# EasyEDA Pro project ProPrj_Y车Y形板_2025-09-30.epro, board 梯形DRV_1
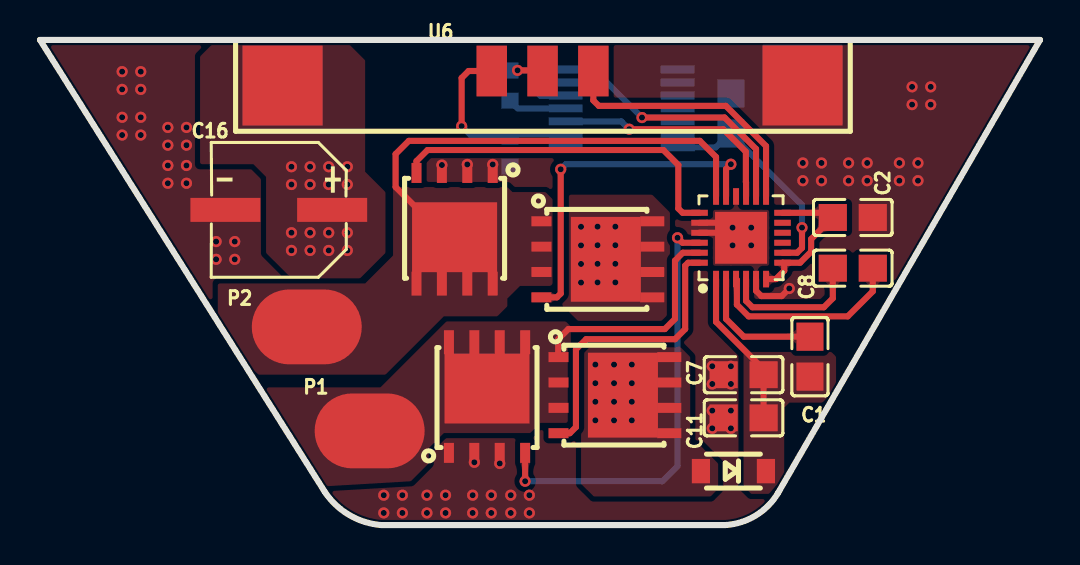
[diagram p12: board, top side]
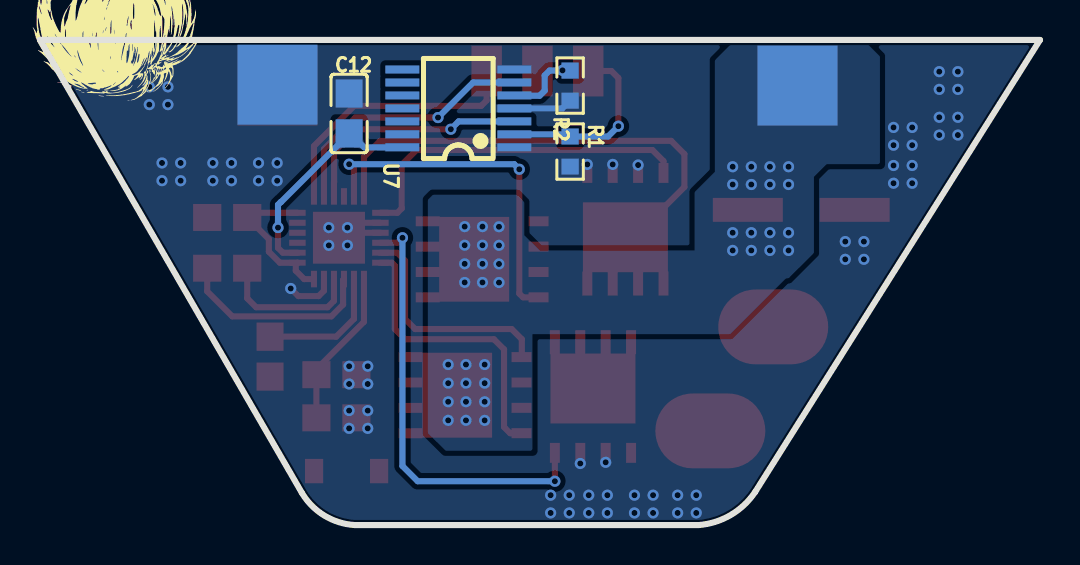
[diagram p13: board, bottom side, seen from below]

Outline 50 x 24.29 mm; copper layers: Top Layer, Bottom Layer. Coordinates in mm from the lower left corner of the outline.
Outline path: 0,24.29 14.24,1.66 arc(15.46,0.51) 17.06,0 34.26,0 arc(35.79,0.48) 36.91,1.62 50,24.29 0,24.29
Stack: Top Layer 0.035mm - / Dielectric1 1.51mm FR4 er 4.5 / Bottom Layer 0.035mm -

## Design rules (mm)
template: 自定义配置
spacing copperThickness1oz (default): track to track 0.152, other pairs 0.152 to 0.3
spacing copperThickness2oz: track to track 0.203, other pairs 0.152 to 0.3
track width copperThickness1oz (default): min 0.254, default 0.254, max 2.54
track width copperThickness2oz: min 0.203, default 0.254, max 2.54
differential pair differentialPair (default): width min 0.127, default 0.254, max 2.54; gap min 0.152, default 0.152
via viaSize (default): diameter min 0.5, default 0.61, max 10; hole min 0.3, default 0.305, max 6.299

## Placement (name value [footprint] x y rotation side)
C1  1uF  [C0805]  38.5 8.43 270 top
C2  1uF  [C0805]  40.64 15.4 180 top
C7  100nF  [C0805]  35.18 7.53 180 top
C8  100nF  [C0805]  40.64 12.86 0 top
C11  10uF  [C0805]  35.18 5.37 180 top
C12  1uF  [C0805]  34.54 20.61 270 bottom
C16  220uF  [CAP-SMD_BD6.3-L6.6-W6.6-FD]  11.94 15.78 180 top
D2  1N5819W  [SOD-123_L2.7-W1.6-LS3.7-R-RD]  34.67 2.7 180 top
P1  WirePad  [WirePad-4x6]  16.48 4.72 0 top
P2  WirePad  [WirePad-4x6]  13.34 9.92 0 top
Q1  TPH1R403NL  [DSOP-8_L5.0-W5.0-P1.27-LS6.0-BL-EP]  28.7 6.5 270 top
Q2  TPH1R403NL  [DSOP-8_L5.0-W5.0-P1.27-LS6.0-BL-EP]  22.35 6.39 0 top
Q3  TPH1R403NL  [DSOP-8_L5.0-W5.0-P1.27-LS6.0-BL-EP]  27.84 13.31 270 top
Q4  TPH1R403NL  [DSOP-8_L5.0-W5.0-P1.27-LS6.0-BL-EP]  20.73 14.86 180 top
R1  10kΩ  [R0603]  23.5 18.7 270 bottom
R2  10kΩ  [R0603]  23.5 22.01 90 bottom
U4  DRV8701ERGET  [VQFN-24_L4.0-W4.0-P0.50-BL-EP2.5]  35.05 14.39 0 top
U6  -  [DRV8701连接焊盘]  9.78 24.29 0 top
U7  SN74HC125PW(LX)  [TSSOP-14_L5.0-W4.4-P0.65-LS6.4-BL]  29.08 20.86 90 bottom

## Footprints (pads in the part's own frame, mm; a bottom-side part is the same pattern mirrored in y, then rotated)
C0805
  rect 1.41x1.35 smd: 1(-1,0) 2(1,0)
CAP-SMD_BD6.3-L6.6-W6.6-FD
  rect 3.5x1.2 smd: 1(-2.67,0) 2(2.67,0)
DRV8701连接焊盘
  rect 4x4 smd far side: 1(28.348,-2.24) 2(2.348,-2.286)
  rect 4x4 smd: 1(28.348,-2.286) 2(2.348,-2.286)
  rect 1.524x2.54 smd: 3(17.888,-1.556) 4(15.348,-1.556) 5(12.808,-1.556)
DSOP-8_L5.0-W5.0-P1.27-LS6.0-BL-EP
  rect 0.5x1 smd: 1(-1.905,-2.77) 2(-0.635,-2.77) 3(0.634,-2.77) 4(1.905,-2.77)
  rect 0.5x1.2 smd: 5(1.905,2.77) 6(0.635,2.77) 7(-0.634,2.77) 8(-1.905,2.77)
  custom 4.25x3.5 smd: 9(0,0.45)
R0603
  rect 0.806x0.864 smd: 1(-0.753,0) 2(0.753,0)
SOD-123_L2.7-W1.6-LS3.7-R-RD
  rect 0.909x1.219 smd: 1(1.625,0) 2(-1.625,0)
TSSOP-14_L5.0-W4.4-P0.65-LS6.4-BL
  rect 0.4x1.7 smd: 1(-1.95,-2.8) 2(-1.3,-2.8) 3(-0.65,-2.8) 4(0,-2.8) 5(0.65,-2.8) 6(1.3,-2.8) 7(1.95,-2.8) 8(1.95,2.8) 9(1.3,2.8) 10(0.65,2.8) 11(0,2.8) 12(-0.65,2.8) 13(-1.3,2.8) 14(-1.95,2.8)
VQFN-24_L4.0-W4.0-P0.50-BL-EP2.5
  rect 0.3x0.828 smd: 1(-1.25,-2.07) 2(-0.75,-2.07) 3(-0.25,-2.07) 4(0.25,-2.07) 5(0.75,-2.07) 6(1.25,-2.07) 13(1.25,2.068) 14(0.75,2.068) 15(0.25,2.068) 16(-0.25,2.068) 17(-0.75,2.068) 18(-1.25,2.068)
  rect 0.828x0.3 smd: 7(2.076,-1.25) 8(2.076,-0.75) 9(2.076,-0.25) 10(2.076,0.25) 11(2.076,0.75) 12(2.076,1.25) 19(-2.075,1.25) 20(-2.075,0.75) 21(-2.075,0.25) 22(-2.075,-0.25) 23(-2.075,-0.75) 24(-2.075,-1.25)
  rect 2.6x2.6 smd: 25(0.001,-0.001)
WirePad-4x6
  rrect 5.5x3.75 smd: 1(0,0)

## Nets
As in the schematic.

Pads without a net: U4 9 10 11; U7 8 9 10 11 12 13

## Via types
v1: diameter 0.559, hole 0.305, Top Layer to Bottom Layer, 119 vias

## Routing (per net, layer and track width the routed paths; a pad name or vN(x,y) marks a point on that pad's centre or on a via; arc(x,y) is an arc through that point)
DVDD: length 11.2
  Top Layer w0.305: v1(38.1,14.89) 38.1,13.88 37.86,13.64 U4.8
  Bottom Layer w0.305: v1(38.1,14.89) 38.1,16.04 37.97,16.16 37.96,16.16 34.54,19.58 C12.2 33.78,18.91 U7.14
GND: length 9.7
  Top Layer w0.305: U4.5 35.8,11.73 36.07,11.47 37.08,11.47 v1(37.47,11.85) ; U4.20 34.3,15.14 34.8,14.64 ; 34.8,14.64 U4.25 ; 34.8,14.64 U4.21
  Bottom Layer w0.305: R2.1 23.88,20.86 U7.4
  vias: v1(4.11,22.7) v1(4.11,21.82) v1(4.11,20.42) v1(4.11,19.53) v1(5.04,22.7) v1(5.04,21.82) v1(5.04,20.42) v1(5.04,19.53) v1(6.39,19.91) v1(6.39,19.02) v1(6.39,18.01) v1(6.39,17.12) v1(7.32,19.91) v1(7.32,19.02) v1(7.32,18.01) v1(7.32,17.12) v1(8.81,14.2) v1(8.81,13.31) v1(9.74,14.2) v1(9.74,13.31) v1(17.19,1.5) v1(17.19,0.61) v1(18.12,1.5) v1(18.12,0.61) v1(19.35,1.5) v1(19.35,0.61) v1(20.09,18.03) v1(20.28,1.5) v1(20.28,0.61) v1(21.37,18.06) v1(21.63,1.5) v1(21.63,0.61) v1(21.72,3.14) v1(22.63,18.06) v1(22.56,1.5) v1(22.56,0.61) v1(22.99,3.08) v1(23.54,1.5) v1(23.54,0.61) v1(24.47,1.5) v1(24.47,0.61) v1(33.61,7.95) v1(33.61,7.06) v1(33.61,5.73) v1(33.61,4.84) v1(34.54,7.95) v1(34.54,7.06) v1(34.54,5.73) v1(34.54,4.84) v1(34.63,14.89) v1(34.63,14.01) v1(35.56,14.89) v1(35.56,14.01) v1(38.14,18.13) v1(38.14,17.24) v1(39.07,18.13) v1(39.07,17.24) v1(40.43,18.13) v1(40.43,17.24) v1(41.36,18.13) v1(41.36,17.24) v1(42.97,18.13) v1(42.97,17.24) v1(43.6,21.94) v1(43.6,21.05) v1(43.9,18.13) v1(43.9,17.24) v1(44.53,21.94) v1(44.53,21.05)
VIN:
  vias: v1(12.57,17.94) v1(12.57,17.05) v1(12.57,14.64) v1(12.57,13.75) v1(13.5,17.94) v1(13.5,17.05) v1(13.5,14.64) v1(13.5,13.75) v1(14.44,17.94) v1(14.44,17.05) v1(14.44,14.64) v1(14.44,13.75) v1(15.37,17.94) v1(15.37,17.05) v1(15.37,14.64) v1(15.37,13.75) v1(27.05,14.94) v1(27.05,14.01) v1(27.05,13.07) v1(27.05,12.14) v1(27.77,8.04) v1(27.77,7.11) v1(27.77,6.17) v1(27.77,5.24) v1(27.88,14.94) v1(27.88,14.01) v1(27.88,13.08) v1(27.88,12.15) v1(28.7,8.04) v1(28.7,7.11) v1(28.7,6.17) v1(28.7,5.24) v1(28.77,14.94) v1(28.77,14.01) v1(28.77,13.08) v1(28.77,12.15) v1(29.59,8.04) v1(29.59,7.11) v1(29.59,6.17) v1(29.59,5.24)
EN: length 13.3
  Top Layer w0.305: v1(30.1,20.41) 34.23,20.41 35.8,18.83 U4.14
  Bottom Layer w0.305: v1(30.1,20.41) 28.34,22.16 U7.6
EN_IN: length 5
  Top Layer w0.305: U6.4 25.09,22.77 v1(23.88,22.77)
  Bottom Layer w0.305: U7.5 26.27,21.5 25.02,21.5 24.76,21.75 24.76,22.51 24.52,22.76 R2.2
MOTOR_A: length 11.5
  Top Layer w0.305: U4.23 32.14,13.64 31.75,13.24 31.75,10.32 31.24,9.81 26.42,9.81 25.91,9.31 25.91,8.43 Q1.1
MOTOR_B: length 24.2
  Top Layer w0.305: 20.73,14.41 20.29,14.41 17.78,16.93 17.78,18.58 18.44,19.24 32.99,19.24 33.8,18.43 U4.18
NSLEEP: length 13.6
  Top Layer w0.305: U4.13 36.3,18.98 34.29,20.99 27.94,20.99 27.67,21.26 U6.3
PH: length 11.9
  Top Layer w0.305: v1(29.46,19.82) 34.16,19.82 35.29,18.69 35.29,17.18 35.3,17.17 U4.15
  Bottom Layer w0.305: v1(29.46,19.82) 29.07,20.21 U7.3
PH_IN: length 9.5
  Top Layer w0.305: U6.5 21.43,22.74 21.08,22.39 v1(21.08,19.97)
  Bottom Layer w0.305: v1(21.08,19.97) 21.6,19.46 R1.1 23.6,19.56 U7.2
$1N8377: length 6.6
  Top Layer w0.305: U4.2 34.3,10.32 35.19,9.43 C1.1
$1N8380: length 10
  Top Layer w0.305: U4.3 34.84,12.27 34.84,11.04 35.43,10.45 40.39,10.45 41.64,11.7 C8.2
$1N8381: length 7.3
  Top Layer w0.305: C8.1 39.64,11.35 39.19,10.91 35.62,10.91 35.3,11.23 U4.4
$1N8402: length 14.7
  Top Layer w0.305: Q1.4 26.49,4.6 26.8,4.91 26.8,8.8 27.31,9.31 31.75,9.31 32.26,9.81 32.26,12.99 32.41,13.14 U4.24
$1N8405: length 22
  Top Layer w0.305: v1(24.26,2.2) Q2.4 ; v1(31.88,14.39) 32.13,14.14 U4.22
  Bottom Layer w0.305: v1(24.26,2.2) 31.12,2.2 31.88,2.96 v1(31.88,14.39)
$1N8407: length 17.6
  Top Layer w0.305: Q4.4 18.82,18.23 19.38,18.78 31.17,18.78 31.92,18.03 31.92,15.85 32.13,15.64 U4.19
$1N8411: length 7.6
  Top Layer w0.305: 36.18,5.74 C7.1 36.18,7.8 33.8,10.18 U4.1
$1N14151: length 7.9
  Top Layer w0.305: U4.6 36.79,12.32 37.21,12.74 37.21,13.05 U4.7 38,13.14 38.56,13.69 38.56,14.32 C2.2 39.41,15.64 U4.12
$1N14297: length 17.6
  Top Layer w0.305: v1(26.03,17.82) 26.03,11.59 25.85,11.4 25.07,11.4 ; v1(34.54,18.07) 34.3,17.83 U4.17
  Bottom Layer w0.305: v1(26.03,17.82) 26.29,18.07 v1(34.54,18.07)

## Copper pours and planes (outline as drawn; the poured copper is in the pictures)
GND on Top Layer: -1.14,29.37 49.78,29.37 49.78,-4.03 -1.14,-4.03
GND on Bottom Layer: -2.54,31.02 49.78,31.02 49.78,-6.7 -2.54,-6.7
VIN on Top Layer: 8.7,24.17 15.37,24.17 16.26,23.28 16.26,17.69 17.27,16.67 17.27,13.62 16,12.35 12.57,12.35 11.3,13.62 11.3,17.43 10.67,18.07 8,18.07 8,23.47
VIN on Top Layer: 26.03,16.55 30.61,16.55 31.5,15.66 31.5,9.43 32.51,8.42 32.51,3.97 33.02,3.97 33.91,3.08 33.91,1.81 33.53,1.43 27.69,1.43 27.05,2.07 27.05,10.07 26.03,11.08
VIN on Bottom Layer: 17.15,13.75 25.02,13.75 25.78,14.51 25.78,16.16 26.16,16.55 30.35,16.55 30.61,16.29 30.61,4.61 29.72,3.72 25.38,3.72 25.38,9.56 15.49,9.56 12.45,12.61 15.87,12.61
VIN on Bottom Layer: 8.7,24.17 15.37,24.17 16.26,23.28 16.26,17.69 17.27,16.67 17.27,13.62 16,12.36 12.57,12.36 11.3,13.62 11.3,17.44 10.67,18.07 8,18.07 8,23.47
MOTOR_A on Top Layer: 20.32,10.2 26.29,10.2 26.54,9.94 26.54,5.24 26.42,5.12 25.02,5.12 24.51,4.61 20.19,4.61 19.43,3.85 19.43,3.08 18.54,2.19 14.22,1.94 9.91,6.89 17.02,6.89
MOTOR_B on Top Layer: 17.65,16.93 23.37,16.93 23.62,16.67 25.27,16.67 25.71,16.23 25.71,12.16 25.53,11.97 24,11.97 23.37,11.34 23.37,10.96 22.86,10.45 20.19,10.45 17.27,7.53 10.92,7.53 8.89,9.56 8.89,12.1 16.26,12.1 17.65,13.5
$1N8411 on Top Layer: 35.18,8.67 39.56,8.67 39.8,8.43 39.8,6.82 39.12,6.13 37.47,6.13 37.21,5.88 37.21,2.46 36.45,1.56 35.56,1.56 35.18,1.94

Small or netless copper shapes (teardrops, artwork), in the pictures only: 25 on Top Layer, 6 on Bottom Layer
